# EAGLE design SO24 (EAGLE 4.14)
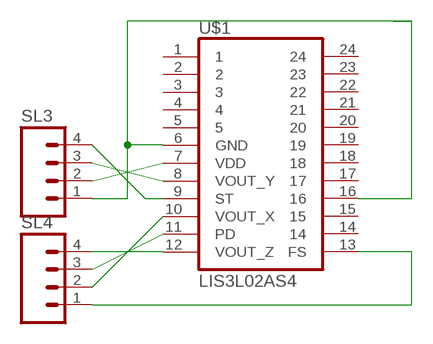
[diagram p0: schematic, sheet 1]

## Parts
SL3  MA04  [04PA]
SL4  MA04  [04PA]
U$1  LIS3L02AS4  [SO24]

## Nets
N$1: SL3.3 U$1.8(VOUT_Y)
N$2: SL3.2 U$1.7(VDD)
N$4: SL4.4 U$1.12(VOUT_Z)
N$5: SL4.2 U$1.10(VOUT_X)
N$6: SL4.3 U$1.11(PD)
N$7: SL3.4 U$1.9(ST)
N$8: SL4.1 U$1.13(FS)
N$10: SL3.1 U$1.6(GND) U$1.16
Unconnected: U$1.1 U$1.2 U$1.3 U$1.4 U$1.5 U$1.14 U$1.15 U$1.17 U$1.18 U$1.19 U$1.20 U$1.21 U$1.22 U$1.23 U$1.24

## Library data of the parts
SL3 SL4 = con-amp-quick:MA04: AMP QUICK CONNECTOR
U$1 = LIS3L02AS4:LIS3L02AS4

## Board
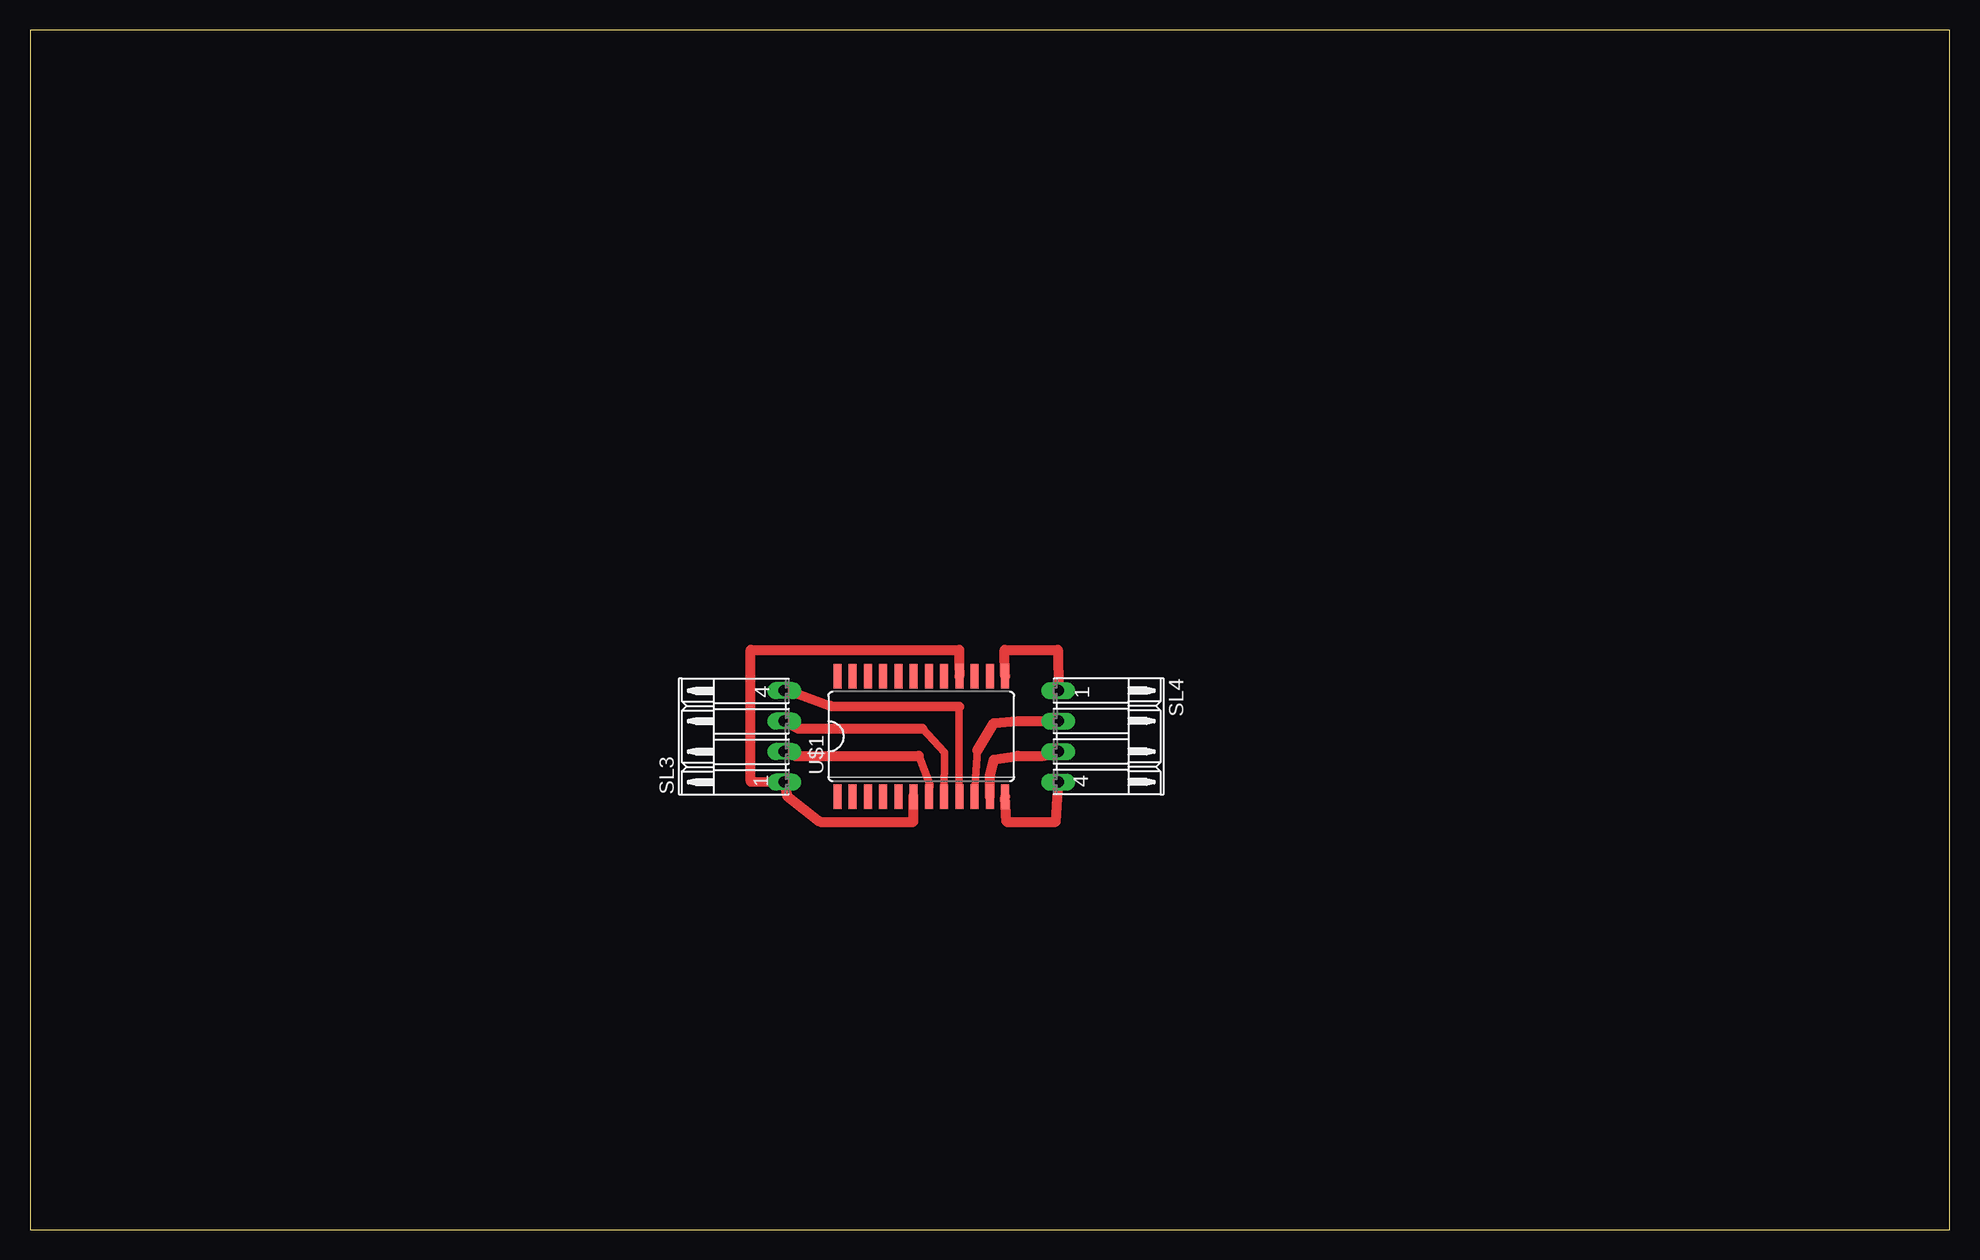
[diagram p1: board, top side]

Size 160 x 100 mm. Coordinates in mm from the lower left corner, seen from the top.
Outline: 0,0 160,0 160,100 0,100 0,0
Copper layers (1*16): Top 0.035mm / dielectric 1.5mm / Bottom 0.035mm
Design rules "default": minimum track width 24mil, minimum drill 24mil, track to track 8mil, track to pad 8mil, pad to pad 8mil, via to via 8mil, smd to smd 8mil, copper to edge 40mil, drill to drill 8mil, minimum pad ring 10mil, minimum via ring 8mil, stop-mask expansion 4mil, vias tented up to drill 0mil, thermal gap 10mil

### Footprints (pad centres in the part's own frame; a part is rotated, then mirrored left to right if it is on the bottom)
04PA = drill 0.914 long: 1 -3.81,0; 2 -1.27,0; 3 1.27,0; 4 3.81,0
SO24 = smd 0.66 x 2.032: 1 -8.255,-5.029; 2 -6.985,-5.029; 3 -5.715,-5.029; 4 -4.445,-5.029; 5 -3.175,-5.029; 6 -1.905,-5.029; 7 -0.635,-5.029; 8 0.635,-5.029; 9 1.905,-5.029; 10 3.175,-5.029; 11 4.445,-5.029; 12 5.715,-5.029; 13 5.715,5.029; 14 4.445,5.029; 15 3.175,5.029; 16 1.905,5.029; 17 0.635,5.029; 18 -0.635,5.029; 19 -1.905,5.029; 20 -3.175,5.029; 21 -4.445,5.029; 22 -5.715,5.029; 23 -6.985,5.029; 24 -8.255,5.029

### Placement (x,y rotation side)
SL3  62.86,41.11 90 top
SL4  85.72,41.11 270 top
U$1  75.56,41.11 0 top

### Tracks (layer width: path | path; a pad name or v marks a point on that pad's centre or on a via)
N$1
  Top 0.61: 74.39,41.77 76.22,39.79 U$1.8
  Top 0.813: 74.39,41.77 64.03,41.77 SL3.3
N$2
  Top 0.61: 74.09,39.48 75,37.05 U$1.7 | 63.72,39.48 64.03,39.48 SL3.2
  Top 0.813: 63.72,39.48 74.09,39.48
N$4
  Top 0.813: U$1.12 81.4,34 85.52,34 SL4.4
N$5
  Top 0.61: 78.96,39.94 78.81,37.66 U$1.10
  Top 0.813: 78.96,39.94 80.33,42.23 82.32,42.38 SL4.2
N$6
  Top 0.813: U$1.11 80.03,37.81 80.33,39.18 82.32,39.48 84.45,39.48 SL4.3
N$7
  Top 0.61: 77.44,43.6 77.44,37.05 U$1.9
  Top 0.813: 77.44,43.6 66.72,43.65 64.03,44.67 SL3.4
N$8
  Top 0.813: U$1.13 81.25,48.32 85.67,48.32 SL4.1
N$10
  Top 0.61: 73.63,36.13 U$1.6
  Top 0.813: 73.63,36.13 73.63,34 65.86,34 63.11,36.13 SL3.1 60.07,37.35 60.07,48.32 77.44,48.32 77.44,47.1 U$1.16